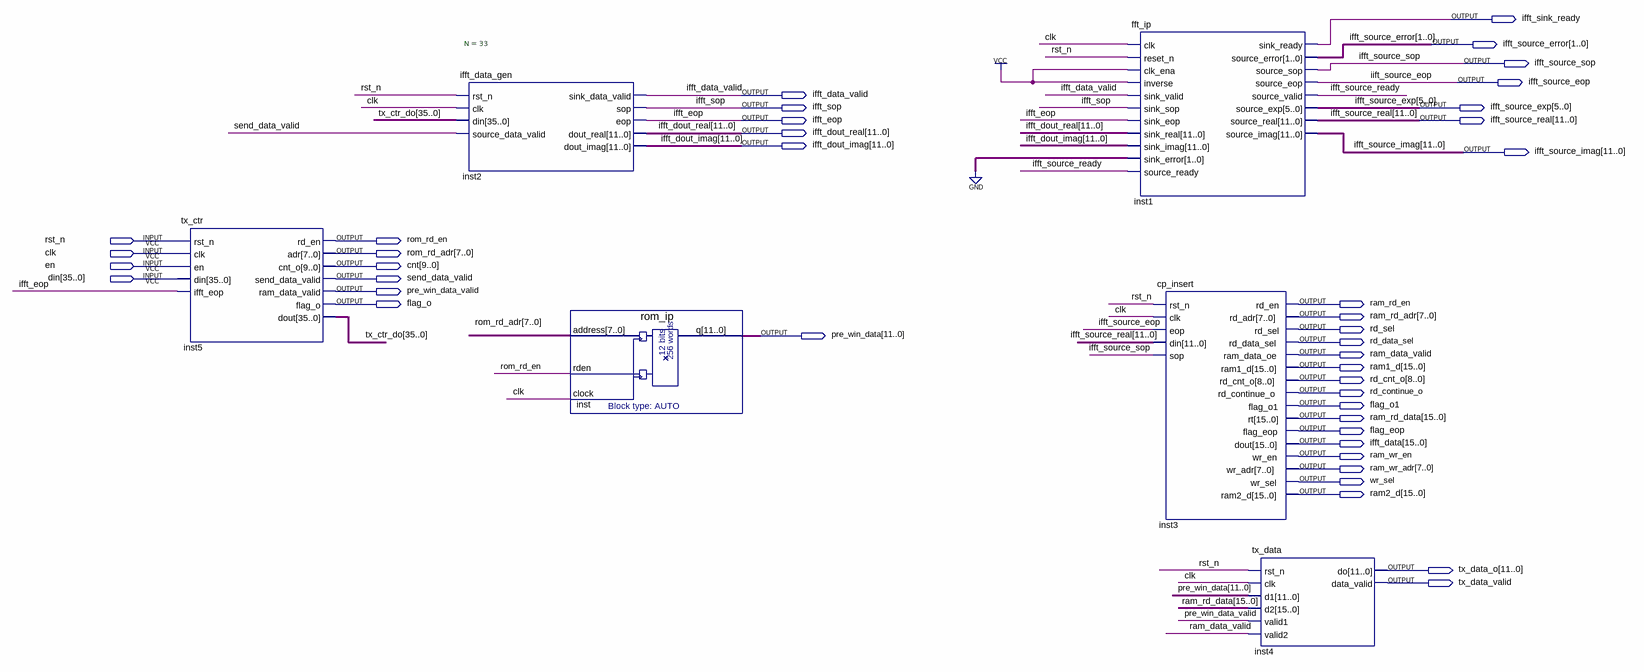
[diagram p0: schematic sheet]
// Quartus schematic transfer.bdf as structural Verilog: 6 symbols, 41 pins
module transfer (
  input  rst_n,
  input  clk,
  input  en,
  input  [35:0] din,
  output ifft_sink_ready,
  output [1:0] ifft_source_error,
  output ifft_source_sop,
  output ifft_source_eop,
  output ifft_data_valid,
  output ifft_sop,
  output [5:0] ifft_source_exp,
  output ifft_eop,
  output [11:0] ifft_source_real,
  output [11:0] ifft_dout_real,
  output [11:0] ifft_dout_imag,
  output [11:0] ifft_source_imag,
  output rom_rd_en,
  output [7:0] rom_rd_adr,
  output [9:0] cnt,
  output send_data_valid,
  output pre_win_data_valid,
  output flag_o,
  output ram_rd_en,
  output [7:0] ram_rd_adr,
  output rd_sel,
  output [11:0] pre_win_data,
  output rd_data_sel,
  output ram_data_valid,
  output [15:0] ram1_d,
  output [8:0] rd_cnt_o,
  output rd_continue_o,
  output flag_o1,
  output [15:0] ram_rd_data,
  output flag_eop,
  output [15:0] ifft_data,
  output ram_wr_en,
  output [7:0] ram_wr_adr,
  output wr_sel,
  output [15:0] ram2_d,
  output [11:0] tx_data_o,
  output tx_data_valid
);

  wire ifft_source_ready;
  wire [35:0] tx_ctr_do;

  tx_ctr inst5 (
    .rst_n(rst_n), .clk(clk), .en(en), .din(din), .ifft_eop(ifft_eop), .rd_en(rom_rd_en), .adr(rom_rd_adr),
    .cnt_o(cnt), .send_data_valid(send_data_valid), .ram_data_valid(pre_win_data_valid), .flag_o(flag_o),
    .dout(tx_ctr_do));
  ifft_data_gen #(.N(33)) inst2 (
    .rst_n(rst_n), .clk(clk), .din(tx_ctr_do), .source_data_valid(send_data_valid),
    .sink_data_valid(ifft_data_valid), .sop(ifft_sop), .eop(ifft_eop), .dout_real(ifft_dout_real),
    .dout_imag(ifft_dout_imag));
  rom_ip inst (.address(rom_rd_adr), .rden(rom_rd_en), .clock(clk), .q(pre_win_data));
  fft_ip inst1 (
    .clk(clk), .reset_n(rst_n), .clk_ena(1'b1), .inverse(1'b1), .sink_valid(ifft_data_valid),
    .sink_sop(ifft_sop), .sink_eop(ifft_eop), .sink_real(ifft_dout_real), .sink_imag(ifft_dout_imag),
    .sink_error(2'b00), .source_ready(ifft_source_ready), .sink_ready(ifft_sink_ready),
    .source_error(ifft_source_error), .source_sop(ifft_source_sop), .source_eop(ifft_source_eop),
    .source_valid(ifft_source_ready), .source_exp(ifft_source_exp), .source_real(ifft_source_real),
    .source_imag(ifft_source_imag));
  cp_insert inst3 (
    .rst_n(rst_n), .clk(clk), .eop(ifft_source_eop), .din(ifft_source_real), .sop(ifft_source_sop),
    .rd_en(ram_rd_en), .rd_adr(ram_rd_adr), .rd_sel(rd_sel), .rd_data_sel(rd_data_sel),
    .ram_data_oe(ram_data_valid), .ram1_d(ram1_d), .rd_cnt_o(rd_cnt_o), .rd_continue_o(rd_continue_o),
    .flag_o1(flag_o1), .rt(ram_rd_data), .flag_eop(flag_eop), .dout(ifft_data), .wr_en(ram_wr_en),
    .wr_adr(ram_wr_adr), .wr_sel(wr_sel), .ram2_d(ram2_d));
  tx_data inst4 (
    .rst_n(rst_n), .clk(clk), .d1(pre_win_data), .d2(ram_rd_data), .valid1(pre_win_data_valid),
    .valid2(ram_data_valid), .\do (tx_data_o), .data_valid(tx_data_valid));

  // Other names for the same wires on the sheet: iift_source_eop = ifft_source_eop
endmodule
